# Altium schematic sheet CH634W6G.SchDoc
size A4; SheetNumber: 3; SheetTotal: 4
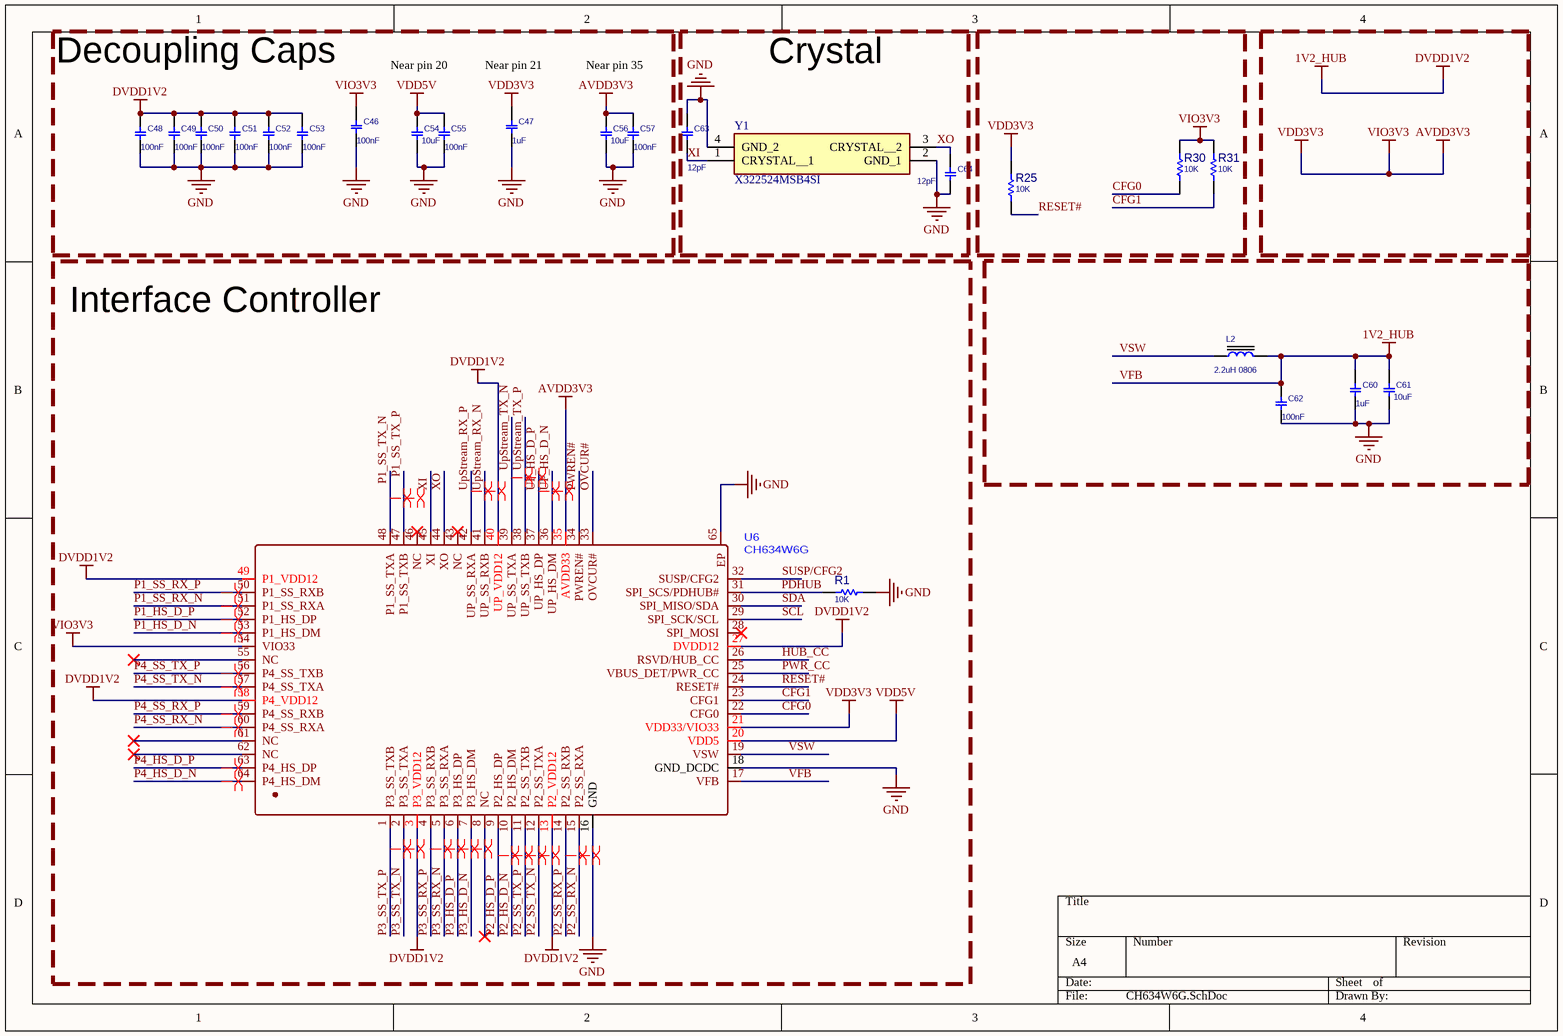
[diagram p0: CH634W6G.SchDoc]

## Parts
C46  100nF  [C0402]
C47  1uF  [C0402]
C48  100nF  [C0402]
C49  100nF  [C0402]
C50  100nF  [C0402]
C51  100nF  [C0402]
C52  100nF  [C0402]
C53  100nF  [C0402]
C54  10uF  [C0603]
C55  100nF  [C0402]
C56  10uF  [C0603]
C57  100nF  [C0402]
C60  1uF  [C0402]
C61  10uF  [C0603]
C62  100nF  [C0402]
C63  12pF  [C0402]
C64  12pF  [C0402]
L2  2.2uH 0806  [L0806]
R1  10K  [R0402]
R25  10K  [R0402]
R30  10K  [R0402]
R31  10K  [R0402]
U6  CH634W6G  [CH634w]
Y1  X322524MSB4SI  [X1E0000210264]

## Blocks framed on the sheet
Decoupling Caps: C46-C57
Crystal: C63 C64 Y1
Interface Controller: R1 U6

## Nets
AVDD3V3: C46.2 C47.2 C56.2 C57.2 R25.1 R30.1 R31.1 U6.21(VDD33/VIO33) U6.35(AVDD33) U6.54(VIO33)  [also labelled VDD3V3, VIO3V3]
GND: C46.1 C47.1 C48.1 C49.1 C50.1 C51.1 C52.1 C53.1 C54.1 C55.1 C56.1 C57.1 C60.1 C61.1 C62.1 C63.2 C64.2 R1.2 U6.16(GND) U6.18(GND_DCDC) U6.65(EP) Y1.2(GND_1) Y1.4(GND_2)
VDD5V: C54.2 C55.2 U6.20(VDD5)
VFB: C48.2 C49.2 C50.2 C51.2 C52.2 C53.2 C60.2 C61.2 C62.2 L2.2 U6.3(P3_VDD12) U6.13(P2_VDD12) U6.17(VFB) U6.27(DVDD12) U6.40(UP_VDD12) U6.49(P1_VDD12) U6.58(P4_VDD12)  [also labelled 1V2_HUB, DVDD1V2]
CFG0: R30.2 U6.22(CFG0)
CFG1: R31.2 U6.23(CFG1)
HUB_CC: U6.26(RSVD/HUB_CC)
OVCUR#: U6.33(OVCUR#)
P1_HS_D_N: U6.53(P1_HS_DM)
P1_HS_D_P: U6.52(P1_HS_DP)
P1_SS_RX_N: U6.51(P1_SS_RXA)
P1_SS_RX_P: U6.50(P1_SS_RXB)
P1_SS_TX_N: U6.48(P1_SS_TXA)
P1_SS_TX_P: U6.47(P1_SS_TXB)
P2_HS_D_N: U6.10(P2_HS_DM)
P2_HS_D_P: U6.9(P2_HS_DP)
P2_SS_RX_N: U6.15(P2_SS_RXA)
P2_SS_RX_P: U6.14(P2_SS_RXB)
P2_SS_TX_N: U6.12(P2_SS_TXA)
P2_SS_TX_P: U6.11(P2_SS_TXB)
P3_HS_D_N: U6.7(P3_HS_DM)
P3_HS_D_P: U6.6(P3_HS_DP)
P3_SS_RX_N: U6.5(P3_SS_RXA)
P3_SS_RX_P: U6.4(P3_SS_RXB)
P3_SS_TX_N: U6.2(P3_SS_TXA)
P3_SS_TX_P: U6.1(P3_SS_TXB)
P4_HS_D_N: U6.64(P4_HS_DM)
P4_HS_D_P: U6.63(P4_HS_DP)
P4_SS_RX_N: U6.60(P4_SS_RXA)
P4_SS_RX_P: U6.59(P4_SS_RXB)
P4_SS_TX_N: U6.57(P4_SS_TXA)
P4_SS_TX_P: U6.56(P4_SS_TXB)
PDHUB: R1.1 U6.31(SPI_SCS/PDHUB#)
PWR_CC: U6.25(VBUS_DET/PWR_CC)
PWREN#: U6.34(PWREN#)
RESET#: R25.2 U6.24(RESET#)
SCL: U6.29(SPI_SCK/SCL)
SDA: U6.30(SPI_MISO/SDA)
SUSP/CFG2: U6.32(SUSP/CFG2)
UP_HS_D_N: U6.36(UP_HS_DM)
UP_HS_D_P: U6.37(UP_HS_DP)
UpStream_RX_N: U6.41(UP_SS_RXB)
UpStream_RX_P: U6.42(UP_SS_RXA)
UpStream_TX_N: U6.39(UP_SS_TXA)
UpStream_TX_P: U6.38(UP_SS_TXB)
VSW: L2.1 U6.19(VSW)
XI: C63.1 U6.45(XI) Y1.1(CRYSTAL__1)
XO: C64.1 U6.44(XO) Y1.3(CRYSTAL__2)

Not connected (* = marked no-connect by the designer): U6 8(NC)* 28(SPI_MOSI)* 43(NC)* 46(NC)* 55(NC)* 61(NC)* 62(NC)*

## Layout directives
differential pair; rule Differential Pairs Routing [Pref Gap = 5mil    Min Gap  = 5mil    Max Gap  = 5milPref Width = 4.347mil    Min Width  = 2.255mil    Max Width  = 4.347mil]; differential pair class SuperSpeed: P1_HS_D_N, P1_HS_D_P, P1_SS_RX_N, P1_SS_RX_P, P1_SS_TX_N, P1_SS_TX_P, P2_HS_D_N, P2_HS_D_P, P2_SS_RX_N, P2_SS_RX_P, P2_SS_TX_N, P2_SS_TX_P, P3_HS_D_N, P3_HS_D_P, P3_SS_RX_N, P3_SS_RX_P, P3_SS_TX_N, P3_SS_TX_P, P4_HS_D_N, P4_HS_D_P, P4_SS_RX_N, P4_SS_RX_P, P4_SS_TX_N, P4_SS_TX_P, UP_HS_D_N, UP_HS_D_P, UpStream_RX_N, UpStream_RX_P, UpStream_TX_N, UpStream_TX_P

## Notes on the sheet
- Near pin 20
- Near pin 21
- Near pin 35

## Library data of the parts
C46-C53 C55 C57 C60 C62-C64 = CAP_SMD_MLCC_0402
C54 C56 C61 = CAP_SMD_MLCC_0603
L2 = IND_SMD_1uH_2.3A_0806: SLW201610S2R2MST
R1 R25 R30 R31 = RES_SMD_0402: RESISTOR, SMD
Y1 = X1E0000210264: Crystal or Oscillator; Manufacturer_Part_Number: X322524MSB4SI